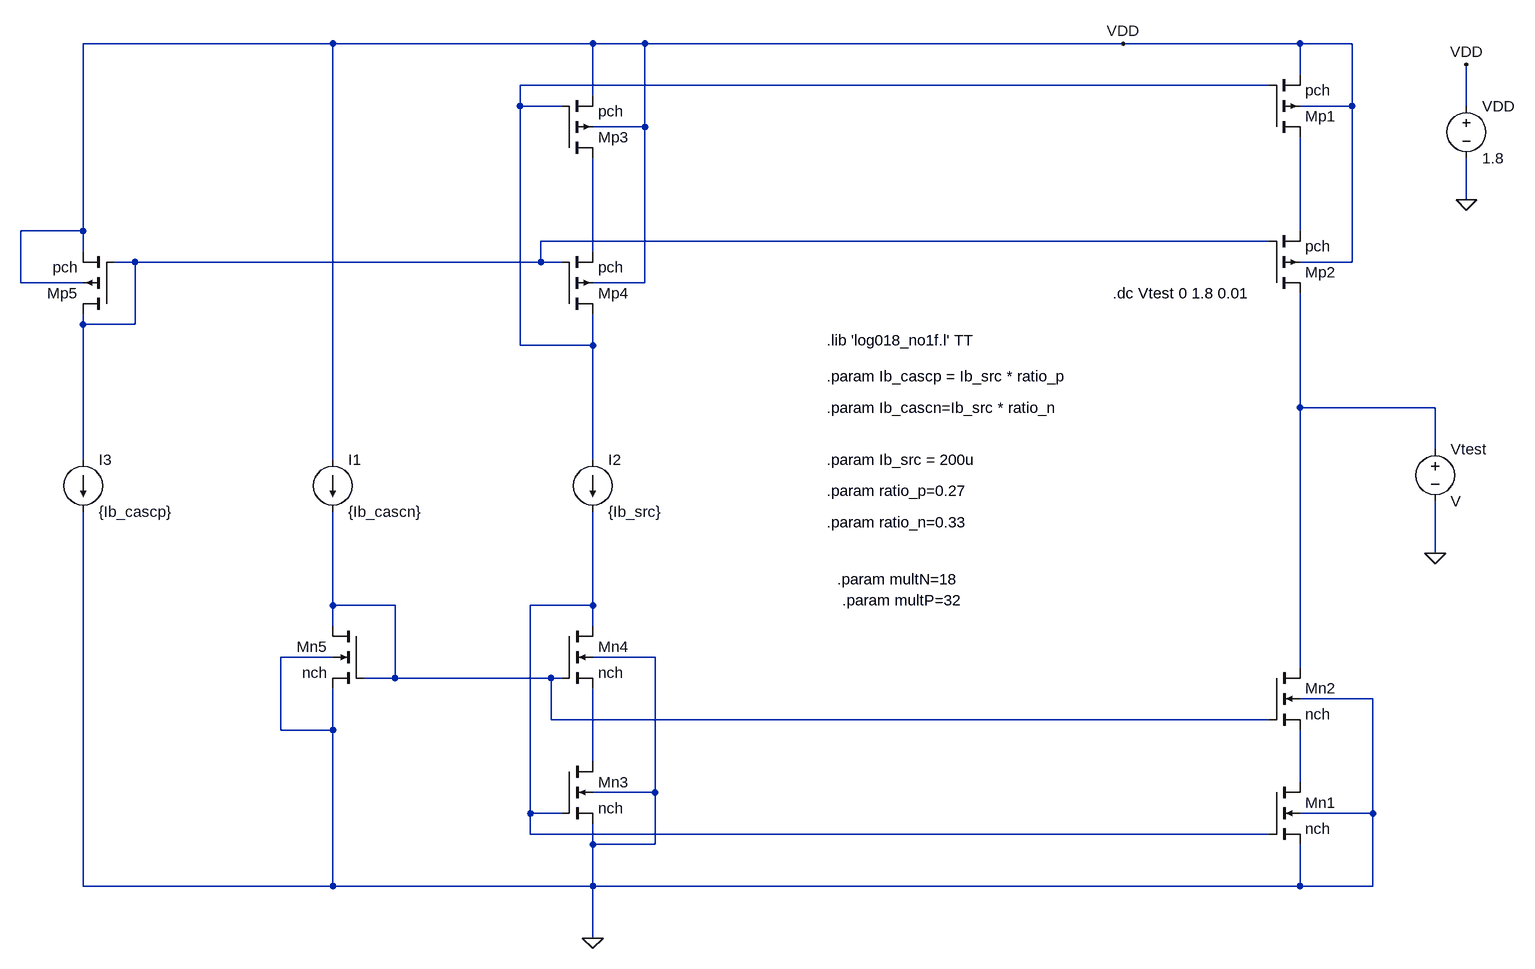
[diagram p0: schematic BIAS.asc]
BIAS.asc, the LTspice schematic file:
Version 4
SHEET 1 1736 1384
WIRE -304 -32 -688 -32
WIRE 96 -32 -304 -32
WIRE 176 -32 96 -32
WIRE 912 -32 176 -32
WIRE 1184 -32 912 -32
WIRE 1264 -32 1184 -32
WIRE 1184 16 1184 -32
WIRE 1136 32 -16 32
WIRE 96 48 96 -32
WIRE -16 64 -16 32
WIRE 48 64 -16 64
WIRE 1264 64 1264 -32
WIRE 1264 64 1184 64
WIRE 1440 64 1440 0
WIRE 176 96 176 -32
WIRE 176 96 96 96
WIRE 1440 208 1440 144
WIRE -688 256 -688 -32
WIRE -688 256 -784 256
WIRE 1184 256 1184 112
WIRE 1136 272 16 272
WIRE -688 288 -688 256
WIRE 96 288 96 144
WIRE -608 304 -640 304
WIRE 16 304 16 272
WIRE 16 304 -608 304
WIRE 48 304 16 304
WIRE 1264 304 1264 64
WIRE 1264 304 1184 304
WIRE -784 336 -784 256
WIRE -688 336 -784 336
WIRE 176 336 176 96
WIRE 176 336 96 336
WIRE -688 400 -688 384
WIRE -608 400 -608 304
WIRE -608 400 -688 400
WIRE -16 432 -16 64
WIRE 96 432 96 384
WIRE 96 432 -16 432
WIRE 1184 528 1184 352
WIRE 1392 528 1184 528
WIRE 1392 592 1392 528
WIRE -688 608 -688 400
WIRE -304 608 -304 -32
WIRE 96 608 96 432
WIRE 1392 752 1392 672
WIRE -304 832 -304 688
WIRE -208 832 -304 832
WIRE 96 832 96 688
WIRE 96 832 0 832
WIRE -304 864 -304 832
WIRE 96 864 96 832
WIRE -304 912 -384 912
WIRE 192 912 96 912
WIRE 1184 928 1184 528
WIRE -208 944 -208 832
WIRE -208 944 -256 944
WIRE 32 944 -208 944
WIRE 48 944 32 944
WIRE 1296 976 1184 976
WIRE 32 1008 32 944
WIRE 1136 1008 32 1008
WIRE -384 1024 -384 912
WIRE -304 1024 -304 960
WIRE -304 1024 -384 1024
WIRE 96 1072 96 960
WIRE 1184 1104 1184 1024
WIRE 192 1120 192 912
WIRE 192 1120 96 1120
WIRE 0 1152 0 832
WIRE 48 1152 0 1152
WIRE 1296 1152 1296 976
WIRE 1296 1152 1184 1152
WIRE 0 1184 0 1152
WIRE 1136 1184 0 1184
WIRE 96 1200 96 1168
WIRE 192 1200 192 1120
WIRE 192 1200 96 1200
WIRE -688 1264 -688 688
WIRE -304 1264 -304 1024
WIRE -304 1264 -688 1264
WIRE 96 1264 96 1200
WIRE 96 1264 -304 1264
WIRE 1184 1264 1184 1200
WIRE 1184 1264 96 1264
WIRE 1296 1264 1296 1152
WIRE 1296 1264 1184 1264
WIRE 96 1344 96 1264
FLAG 96 1344 0
FLAG 1440 208 0
FLAG 1440 0 VDD
FLAG 912 -32 VDD
FLAG 1392 752 0
DATAFLAG 96 240 ""
DATAFLAG 96 432 ""
DATAFLAG 96 976 ""
DATAFLAG 96 1200 ""
DATAFLAG 96 -32 ""
DATAFLAG 96 816 ""
DATAFLAG -16 64 ""
DATAFLAG 176 96 ""
DATAFLAG 16 1152 ""
DATAFLAG 192 1120 ""
DATAFLAG 16 304 ""
DATAFLAG 32 944 ""
SYMBOL nmos4 1136 1104 R0
SYMATTR InstName Mn1
SYMATTR Value2 l=0.18u w=1u m=multN
SYMATTR Value nch
SYMBOL pmos4 1136 112 M180
SYMATTR InstName Mp1
SYMATTR Value2 l=0.18u w=3.3u m=multP
SYMATTR Value pch
SYMBOL nmos4 1136 928 R0
SYMATTR InstName Mn2
SYMATTR Value2 l=0.18u w=1u m=multN
SYMATTR Value nch
SYMBOL pmos4 1136 352 M180
SYMATTR InstName Mp2
SYMATTR Value2 l=0.18u w=3.3u m=multP
SYMATTR Value pch
SYMBOL nmos4 48 1072 R0
SYMATTR InstName Mn3
SYMATTR Value2 l=0.18u w=1u m=multN
SYMATTR Value nch
SYMBOL pmos4 48 144 M180
SYMATTR InstName Mp3
SYMATTR Value2 l=0.18u w=3.3u m=multP
SYMATTR Value pch
SYMBOL nmos4 48 864 R0
SYMATTR InstName Mn4
SYMATTR Value2 l=0.18u w=1u m=multN
SYMATTR Value nch
SYMBOL pmos4 48 384 M180
SYMATTR InstName Mp4
SYMATTR Value2 l=0.18u w=3.3u m=multP
SYMATTR Value pch
SYMBOL nmos4 -256 864 M0
SYMATTR InstName Mn5
SYMATTR Value2 l=0.18u w=1u
SYMATTR Value nch
SYMBOL pmos4 -640 384 R180
SYMATTR InstName Mp5
SYMATTR Value2 l=0.18u w=3.3u
SYMATTR Value pch
SYMBOL current -304 608 R0
SYMATTR InstName I1
SYMATTR Value {Ib_cascn}
SYMBOL current 96 608 R0
SYMATTR InstName I2
SYMATTR Value {Ib_src}
SYMBOL current -688 608 R0
SYMATTR InstName I3
SYMATTR Value {Ib_cascp}
SYMBOL voltage 1440 48 R0
SYMATTR InstName VDD
SYMATTR Value 1.8
SYMBOL voltage 1392 576 R0
SYMATTR InstName Vtest
TEXT 456 424 Left 2 !.lib 'log018_no1f.l' TT
TEXT 456 480 Left 2 !.param Ib_cascp = Ib_src * ratio_p
TEXT 456 528 Left 2 !.param Ib_cascn=Ib_src * ratio_n
TEXT 456 608 Left 2 !.param Ib_src = 200u
TEXT 456 656 Left 2 !.param ratio_p=0.27
TEXT 456 704 Left 2 !.param ratio_n=0.33
TEXT 896 352 Left 2 !.dc Vtest 0 1.8 0.01
TEXT 472 792 Left 2 !.param multN=18
TEXT 480 824 Left 2 !.param multP=32

The netlist it stands for:
* BIAS.asc
Mn1 N009 N007 0 0 nch l=0.18u w=1u m=multN
Mp1 N002 N001 VDD VDD pch l=0.18u w=3.3u m=multP
Mn2 N005 N006 N009 0 nch l=0.18u w=1u m=multN
Mp2 N005 N003 N002 VDD pch l=0.18u w=3.3u m=multP
Mn3 N008 N007 0 0 nch l=0.18u w=1u m=multN
Mp3 N004 N001 VDD VDD pch l=0.18u w=3.3u m=multP
Mn4 N007 N006 N008 0 nch l=0.18u w=1u m=multN
Mp4 N001 N003 N004 VDD pch l=0.18u w=3.3u m=multP
Mn5 N006 N006 0 0 nch l=0.18u w=1u
Mp5 N003 N003 VDD VDD pch l=0.18u w=3.3u
I1 VDD N006 {Ib_cascn}
I2 N001 N007 {Ib_src}
I3 N003 0 {Ib_cascp}
VDD VDD 0 1.8
Vtest N005 0 V
.model NMOS NMOS
.model PMOS PMOS
.lib standard.mos
.lib 'log018_no1f.l' TT
.param Ib_cascp = Ib_src * ratio_p
.param Ib_cascn=Ib_src * ratio_n
.param Ib_src = 200u
.param ratio_p=0.27
.param ratio_n=0.33
.dc Vtest 0 1.8 0.01
.param multN=18
.param multP=32
.backanno
.end

* Results of the author's LTspice run, read from the files saved beside the schematic
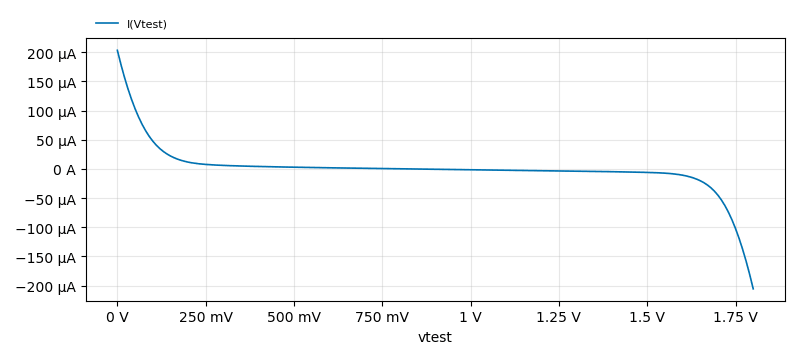
[diagram p1: DC transfer characteristic of BIAS.asc, plotted from the saved traces]
* DC transfer characteristic, 1 run:
*   I(Vtest): 203.1 µA at vtest=0 V, -205.6 µA at vtest=1.8 V, min -205.6 µA, max 203.1 µA